# Altium schematic sheet Pmod_KYPD.SchDoc
size A4; SheetNumber: 1; SheetTotal: 1
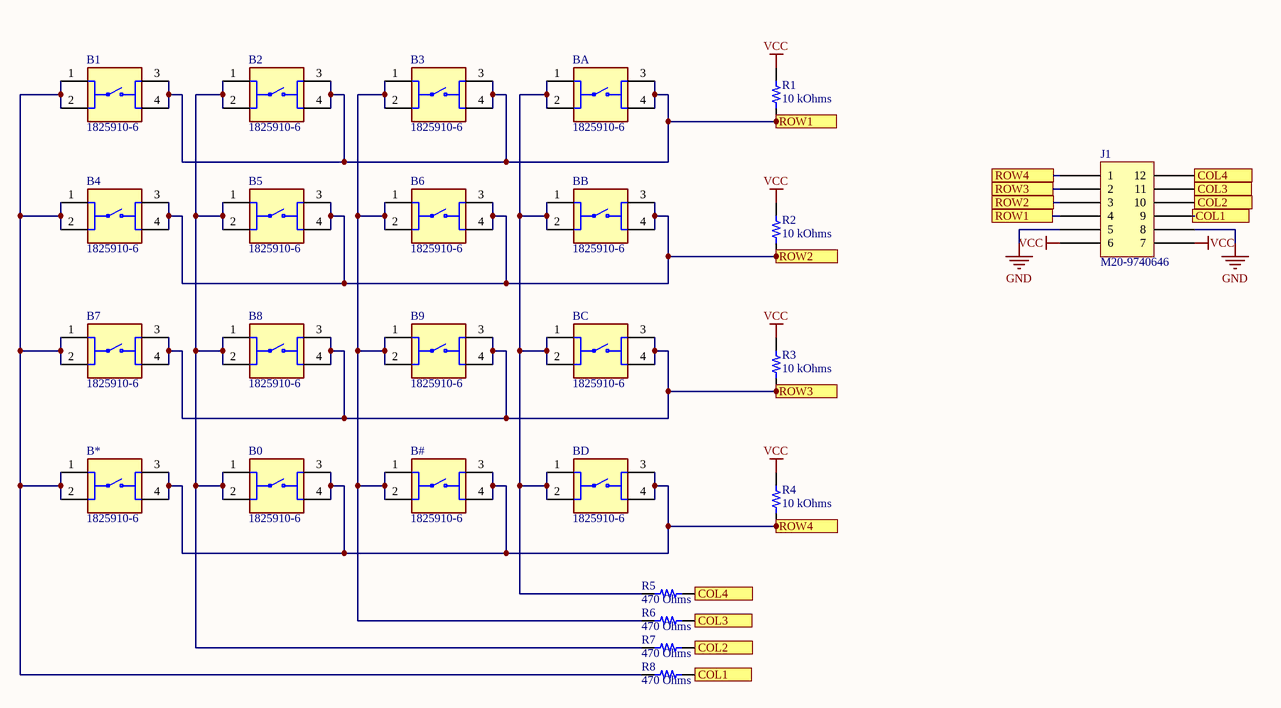
[diagram p0: Pmod_KYPD.SchDoc]

## Parts
B0  1825910-6  [SW_1825910-6-4]
B1  1825910-6  [SW_1825910-6-4]
B2  1825910-6  [SW_1825910-6-4]
B3  1825910-6  [SW_1825910-6-4]
B4  1825910-6  [SW_1825910-6-4]
B5  1825910-6  [SW_1825910-6-4]
B6  1825910-6  [SW_1825910-6-4]
B7  1825910-6  [SW_1825910-6-4]
B8  1825910-6  [SW_1825910-6-4]
B9  1825910-6  [SW_1825910-6-4]
B#  1825910-6  [SW_1825910-6-4]
B*  1825910-6  [SW_1825910-6-4]
BA  1825910-6  [SW_1825910-6-4]
BB  1825910-6  [SW_1825910-6-4]
BC  1825910-6  [SW_1825910-6-4]
BD  1825910-6  [SW_1825910-6-4]
J1  M20-9740646  [HARWIN M20-9740645]
R1  10 kOhms  [RES 0805_2012]
R2  10 kOhms  [RES 0805_2012]
R3  10 kOhms  [RES 0805_2012]
R4  10 kOhms  [RES 0805_2012]
R5  470 Ohms  [RES 0805_2012]
R6  470 Ohms  [RES 0805_2012]
R7  470 Ohms  [RES 0805_2012]
R8  470 Ohms  [RES 0805_2012]

## Ports
COL1 (see Pmod_KYPD[3D]), COL1 (see Pmod_KYPD[4B]), COL2 (see Pmod_KYPD[3C]), COL2 (see Pmod_KYPD[4B]), COL3 (see Pmod_KYPD[3C]), COL3 (see Pmod_KYPD[4B]), COL4 (see Pmod_KYPD[3C]), COL4 (see Pmod_KYPD[4B]), ROW1 (see Pmod_KYPD[3A]), ROW1 (see Pmod_KYPD[3B]), ROW2 (see Pmod_KYPD[3B]), ROW3 (see Pmod_KYPD[3B]), ROW4 (see Pmod_KYPD[3B]), ROW4 (see Pmod_KYPD[3C])

## Nets
GND: J1.5 J1.8
VCC: J1.6 J1.7 R1.2 R2.2 R3.2 R4.2
COL1: J1.9 R8.2 ; port COL1
COL2: J1.10 R7.2 ; port COL2
COL3: J1.11 R6.2 ; port COL3
COL4: J1.12 R5.2 ; port COL4
ROW1: B1.3 B1.4 B2.3 B2.4 B3.3 B3.4 BA.3 BA.4 J1.4 R1.1 ; port ROW1
ROW2: B4.3 B4.4 B5.3 B5.4 B6.3 B6.4 BB.3 BB.4 J1.3 R2.1 ; port ROW2
ROW3: B7.3 B7.4 B8.3 B8.4 B9.3 B9.4 BC.3 BC.4 J1.2 R3.1 ; port ROW3
ROW4: B0.3 B0.4 B#.3 B#.4 B*.3 B*.4 BD.3 BD.4 J1.1 R4.1 ; port ROW4
NetB0_1: B0.1 B0.2 B2.1 B2.2 B5.1 B5.2 B8.1 B8.2 R7.1
NetB1_1: B1.1 B1.2 B4.1 B4.2 B7.1 B7.2 B*.1 B*.2 R8.1
NetB3_1: B3.1 B3.2 B6.1 B6.2 B9.1 B9.2 B#.1 B#.2 R6.1
NetBA_1: BA.1 BA.2 BB.1 BB.2 BC.1 BC.2 BD.1 BD.2 R5.1

## Library data of the parts
B0-B9 B# B* BA BB BC BD = 1825910-6: Switch Push Button OFF (ON) SPST Round Button 0.05A 24VDC Momentary Contact PC Pins Thru-Hole; MF: TE Connectivity; Value: *; MP: 1825910-6; Package: None; Check_prices: https://www.snapeda.com/parts/1825910-6/TE+Connectivity+ALCOSWITCH+Switches/view-part/?ref=eda; SnapEDA_Link: https://www.snapeda.com/parts/1825910-6/TE+Connectivity+ALCOSWITCH+Switches/view-part/?ref=snap; Digi-Key_Part_Number: 450-1650-ND; Purchase-URL: https://pricing.snapeda.com/search/part/1825910-6/?ref=eda
J1 = M20-9740646: CONN HEADER R/A 12POS 2.54MM; Part Number: M20-9740646
R1-R4 = TNPU080510K0AWEN00: TNPU0805 10K 0.05% 2PPM E52 E3; Part Number: TNPU080510K0AWEN00; Value: 10 kOhms
R5-R8 = RC0805JR-07470RP: RES SMD 470 OHM 5% 1/8W 0805; Part Number: RC0805JR-07470RP; Value: 470 Ohms